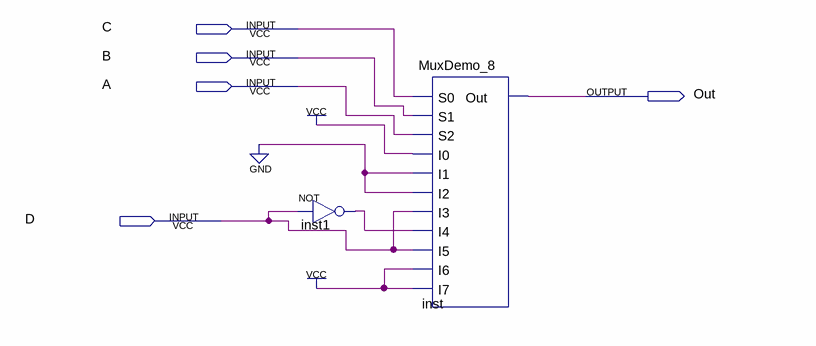
[diagram p0: schematic sheet]
// Quartus schematic Exercicio4.bdf as structural Verilog: 2 symbols, 5 pins
module Exercicio4 (
  input  C,
  input  B,
  input  A,
  input  D,
  output Out
);

  wire inst1_out;

  not inst1 (inst1_out, D);
  MuxDemo_8 inst (
    .S0(C), .S1(B), .S2(A), .I0(1'b1), .I1(1'b0), .I2(1'b0), .I3(D), .I4(inst1_out), .I5(D), .I6(1'b1),
    .I7(1'b1), .Out(Out));
endmodule
